# Altium schematic sheet V1.SchDoc
size A4
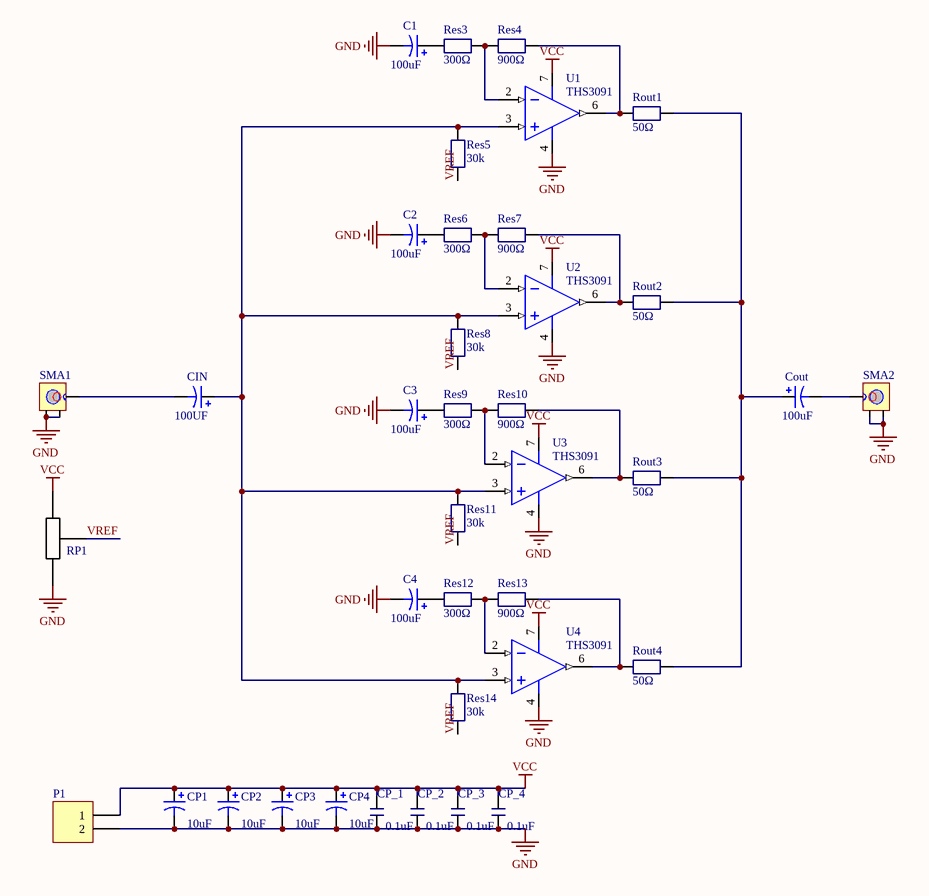
[diagram p0: V1.SchDoc]

## Parts
*  RP1  [dianweiqi]
C1  value 100uF  [CAP1]  (hidden comment: Cap Pol1)
C2  value 100uF  [CAP1]  (hidden comment: Cap Pol1)
C3  value 100uF  [CAP1]  (hidden comment: Cap Pol1)
C4  value 100uF  [CAP1]  (hidden comment: Cap Pol1)
CIN  value 100UF  [CAP1]  (hidden comment: Cap Pol1)
Cout  value 100uF  [CAP1]  (hidden comment: Cap Pol1)
CP1  value 10uF  [CAP_BTAN]  (hidden comment: Cap Pol1)
CP2  value 10uF  [CAP_BTAN]  (hidden comment: Cap Pol1)
CP3  value 10uF  [CAP_BTAN]  (hidden comment: Cap Pol1)
CP4  value 10uF  [CAP_BTAN]  (hidden comment: Cap Pol1)
CP_1  value 0.1uF  [C0805]  (hidden comment: cap)
CP_2  value 0.1uF  [C0805]  (hidden comment: cap)
CP_3  value 0.1uF  [C0805]  (hidden comment: cap)
CP_4  value 0.1uF  [C0805]  (hidden comment: cap)
P1  Header 2  [HDR1X2]  (value not drawn)
Res3  value 300Ω  [R-AXIAL0.3]  (hidden comment: Res)
Res4  value 900Ω  [AXIAL-0.3]  (hidden comment: Res)
Res5  value 30k  [R-AXIAL0.3]  (hidden comment: Res)
Res6  value 300Ω  [R-AXIAL0.3]  (hidden comment: Res)
Res7  value 900Ω  [AXIAL-0.3]  (hidden comment: Res)
Res8  value 30k  [R-AXIAL0.3]  (hidden comment: Res)
Res9  value 300Ω  [R-AXIAL0.3]  (hidden comment: Res)
Res10  value 900Ω  [AXIAL-0.3]  (hidden comment: Res)
Res11  value 30k  [R-AXIAL0.3]  (hidden comment: Res)
Res12  value 300Ω  [R-AXIAL0.3]  (hidden comment: Res)
Res13  value 900Ω  [AXIAL-0.3]  (hidden comment: Res)
Res14  value 30k  [R-AXIAL0.3]  (hidden comment: Res)
Rout1  value 50Ω  [C0805]  (hidden comment: Res)
Rout2  value 50Ω  [C0805]  (hidden comment: Res)
Rout3  value 50Ω  [C0805]  (hidden comment: Res)
Rout4  value 50Ω  [C0805]  (hidden comment: Res)
SMA1  SMA-xie  [sma-xie]  (value not drawn)
SMA2  SMA-xie  [sma-xie]  (value not drawn)
U1  THS3091  [SOIC-8D]
U2  THS3091  [SOIC-8D]
U3  THS3091  [SOIC-8D]
U4  THS3091  [SOIC-8D]

## Nets
GND: *.3 C1.2 C2.2 C3.2 C4.2 CP1.2 CP2.2 CP3.2 CP4.2 CP_1.1 CP_2.1 CP_3.1 CP_4.1 P1.2 SMA1.1(gnd) SMA1.3(gnd) SMA2.1(gnd) SMA2.3(gnd) U1.4(V-) U2.4(V-) U3.4(V-) U4.4(V-)
VCC: *.1 CP1.1 CP2.1 CP3.1 CP4.1 CP_1.2 CP_2.2 CP_3.2 CP_4.2 P1.1 U1.7(V+) U2.7(V+) U3.7(V+) U4.7(V+)
VREF: *.2 Res5.1 Res8.1 Res11.1 Res14.1
NetC1_1: C1.1 Res3.2
NetC2_1: C2.1 Res6.1
NetC3_1: C3.1 Res9.1
NetC4_1: C4.1 Res12.1
NetCIN_1: CIN.1 Res5.2 Res8.2 Res11.2 Res14.2 U1.3(IN+) U2.3(IN+) U3.3(IN+) U4.3(IN+)
NetCIN_2: CIN.2 SMA1.2(signal)
NetCout_1: Cout.1 Rout1.2 Rout2.2 Rout3.2 Rout4.2
NetCout_2: Cout.2 SMA2.2(signal)
NetRes3_1: Res3.1 Res4.2 U1.2(IN-)
NetRes4_1: Res4.1 Rout1.1 U1.6(OUT)
NetRes6_2: Res6.2 Res7.1 U2.2(IN-)
NetRes7_2: Res7.2 Rout2.1 U2.6(OUT)
NetRes9_2: Res9.2 Res10.1 U3.2(IN-)
NetRes10_2: Res10.2 Rout3.1 U3.6(OUT)
NetRes12_2: Res12.2 Res13.1 U4.2(IN-)
NetRes13_2: Res13.2 Rout4.1 U4.6(OUT)

## Library data of the parts
C1-C4 CIN Cout CP1-CP4 = Cap Pol1: Polarized Capacitor (Radial); Published: 8-Jun-2000; LatestRevisionDate: 17-Jul-2002; LatestRevisionNote: Re-released for DXP Platform.; PackageReference: RB7.6-15; Publisher: Altium Limited
CP_1-CP_4 = cap: 贴片电容
P1 = Header 2: Header, 2-Pin; LatestRevisionDate: 17-Jul-2002; LatestRevisionNote: Re-released for DXP Platform.; Publisher: Altium Limited
Res3-Res14 Rout1-Rout4 = Res: 适用于0805的贴片元件，包括磁珠
SMA1 SMA2 = SMA-xie: 外螺内孔，斜角，或直四角斜着放置
U1-U4 = THS3091: 单路高压低失真电流反馈 运放 ,通常申请DDA，即下方带有热焊盘的，有利于散热